# Altium project Main.PrjPcb
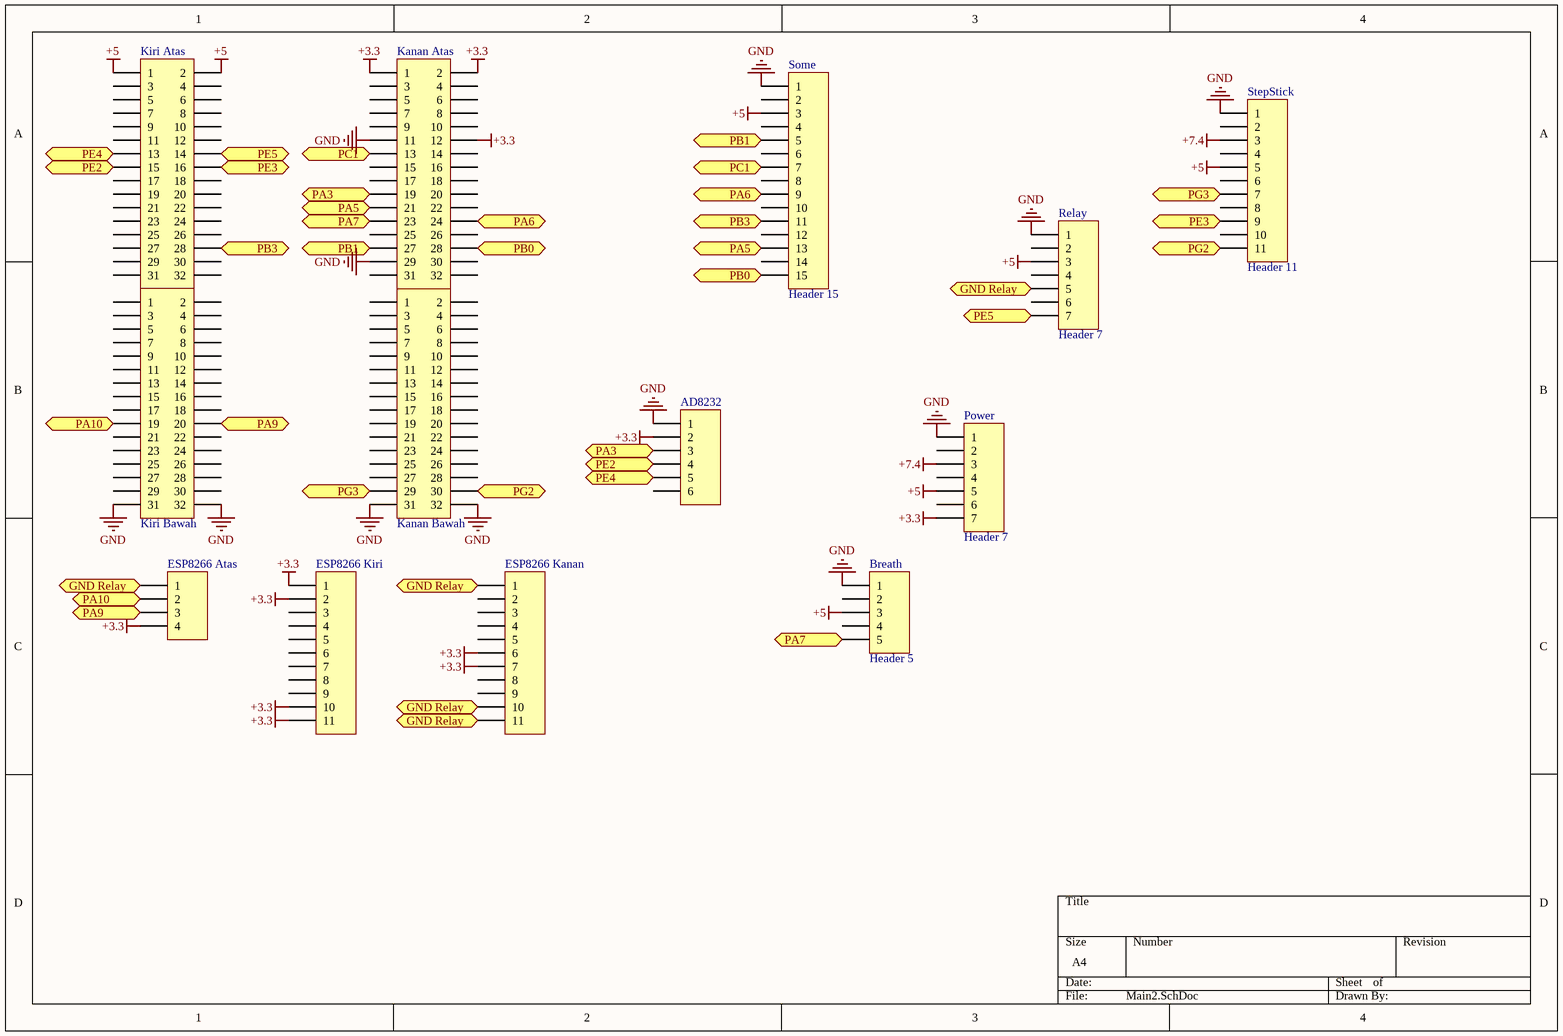
[diagram p0: Main2.SchDoc]
1 sheet, 13 parts. Net scope: flat (ports and power ports of the same name join across sheets).
Board files: MainDone1.PcbDoc, Print3.PcbDoc

## Sheet Main2.SchDoc
size A4

### Parts
AD8232  (no value)  [HDR1X6]
Breath  Header 5  [HDR1X5]
ESP8266_Atas  (no value)  [HDR1X4]
ESP8266_Kanan  (no value)  [HDR1X11]
ESP8266_Kiri  (no value)  [HDR1X11]
Kanan_Atas  (no value)  [HDR2X16]
Kanan_Bawah  (no value)  [HDR2X16]
Kiri_Atas  (no value)  [HDR2X16]
Kiri_Bawah  (no value)  [HDR2X16]
Power  Header 7  [HDR1X7]
Relay  Header 7  [HDR1X7]
Some  Header 15  [HDR1X15]
StepStick  Header 11  [HDR1X11]

### Ports
GND Relay (bidir), PA3 (in), PA3 (out), PA5 (in), PA5 (out), PA6 (in), PA6 (out), PA7, PA9 (in), PA9 (out), PA10 (in), PA10 (out), PB0 (in), PB0 (out), PB1 (in), PB1 (out), PB3 (in), PB3 (out), PC1 (in), PC1 (out), PE2 (in), PE2 (out), PE3 (in), PE3 (out), PE4 (in), PE4 (out), PE5 (in), PE5 (out), PG2 (in), PG2 (out), PG3 (in), PG3 (out)

### Nets
+3.3: AD8232.2 ESP8266_Atas.4 ESP8266_Kanan.6 ESP8266_Kanan.7 ESP8266_Kiri.1 ESP8266_Kiri.2 ESP8266_Kiri.10 ESP8266_Kiri.11 Kanan_Atas.1 Kanan_Atas.2 Kanan_Atas.12 Power.7
+5: Breath.3 Kiri_Atas.1 Kiri_Atas.2 Power.5 Relay.3 Some.3 StepStick.5
+7.4: Power.3 StepStick.3
GND: AD8232.1 Breath.1 Kanan_Atas.11 Kanan_Atas.29 Kanan_Bawah.31 Kanan_Bawah.32 Kiri_Bawah.31 Kiri_Bawah.32 Power.1 Relay.1 Some.1 StepStick.1
NetAD8232_3: AD8232.3 Kanan_Atas.19 ; port PA3
NetAD8232_4: AD8232.4 Kiri_Atas.15 ; port PE2
NetAD8232_5: AD8232.5 Kiri_Atas.13 ; port PE4
NetBreath_5: Breath.5 Kanan_Atas.23 ; port PA7
NetESP8266_Atas_1: ESP8266_Atas.1 ESP8266_Kanan.1 ESP8266_Kanan.10 ESP8266_Kanan.11 Relay.5 ; port GND Relay
NetESP8266_Atas_2: ESP8266_Atas.2 Kiri_Bawah.19 ; port PA10
NetESP8266_Atas_3: ESP8266_Atas.3 Kiri_Bawah.20 ; port PA9
NetKanan_Atas_13: Kanan_Atas.13 Some.7 ; port PC1
NetKanan_Atas_21: Kanan_Atas.21 Some.13 ; port PA5
NetKanan_Atas_24: Kanan_Atas.24 Some.9 ; port PA6
NetKanan_Atas_27: Kanan_Atas.27 Some.5 ; port PB1
NetKanan_Atas_28: Kanan_Atas.28 Some.15 ; port PB0
NetKanan_Bawah_29: Kanan_Bawah.29 StepStick.7 ; port PG3
NetKanan_Bawah_30: Kanan_Bawah.30 StepStick.11 ; port PG2
NetKiri_Atas_14: Kiri_Atas.14 Relay.7 ; port PE5
NetKiri_Atas_16: Kiri_Atas.16 StepStick.9 ; port PE3
NetKiri_Atas_28: Kiri_Atas.28 Some.11 ; port PB3

Not connected (* = marked no-connect by the designer): AD8232 6; Breath 2 4; ESP8266_Kanan 2 3 4 5 8 9; ESP8266_Kiri 3 4 5 6 7 8 9; Kanan_Atas 3 4 5 6 7 8 9 10 14 15 16 17 18 20 22 25 26 30 31 32; Kanan_Bawah 1 2 3 4 5 6 7 8 9 10 11 12 13 14 15 16 17 18 19 20 21 22 23 24 25 26 27 28; Kiri_Atas 3 4 5 6 7 8 9 10 11 12 17 18 19 20 21 22 23 24 25 26 27 29 30 31 32; Kiri_Bawah 1 2 3 4 5 6 7 8 9 10 11 12 13 14 15 16 17 18 21 22 23 24 25 26 27 28 29 30; Power 2 4 6; Relay 2 4 6; Some 2 4 6 8 10 12 14; StepStick 2 4 6 8 10

### Library data of the parts
AD8232 = Header 6: Header, 6-Pin; LatestRevisionDate: 17-Jul-2002; LatestRevisionNote: Re-released for DXP Platform.; Publisher: Altium Limited
Breath = Header 5: Header, 5-Pin; LatestRevisionDate: 17-Jul-2002; LatestRevisionNote: Re-released for DXP Platform.; Publisher: Altium Limited
ESP8266_Atas = Header 4: Header, 4-Pin; LatestRevisionDate: 17-Jul-2002; LatestRevisionNote: Re-released for DXP Platform.; Publisher: Altium Limited
ESP8266_Kanan ESP8266_Kiri StepStick = Header 11: Header, 11-Pin; LatestRevisionDate: 17-Jul-2002; LatestRevisionNote: Re-released for DXP Platform.; Publisher: Altium Limited
Kanan_Atas Kanan_Bawah Kiri_Atas Kiri_Bawah = Header 16X2: Header, 16-Pin, Dual row; LatestRevisionDate: 17-Jul-2002; LatestRevisionNote: Re-released for DXP Platform.; Publisher: Altium Limited
Power Relay = Header 7: Header, 7-Pin; LatestRevisionDate: 17-Jul-2002; LatestRevisionNote: Re-released for DXP Platform.; Publisher: Altium Limited
Some = Header 15: Header, 15-Pin; LatestRevisionDate: 17-Jul-2002; LatestRevisionNote: Re-released for DXP Platform.; Publisher: Altium Limited